# Altium project EVACC_Tester_v1_0.PrjPcb
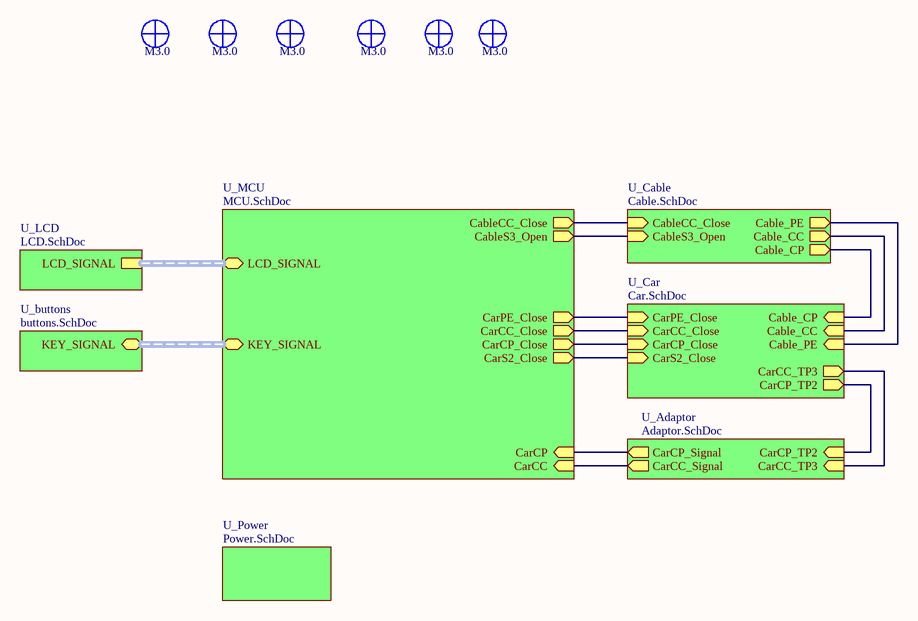
[diagram p0: layout.SchDoc]
8 sheets, 122 parts. Net scope: hierarchical (ports join the sheet entries above them; power ports are global).
Board file: EVACC_Tester_v1_0.PcbDoc
Sheets:
  layout.SchDoc
    U_MCU = MCU.SchDoc
    U_Power = Power.SchDoc
    U_Cable = Cable.SchDoc
    U_Car = Car.SchDoc
    U_LCD = LCD.SchDoc
    U_Adaptor = Adaptor.SchDoc
    U_buttons = buttons.SchDoc

## Sheet layout.SchDoc
size A4

### Parts
H1  M3.0  [SCREW_HOLE_3.5]  (value not drawn)  (no BOM)
H2  M3.0  [SCREW_HOLE_3.5]  (value not drawn)  (no BOM)
H3  M3.0  [SCREW_HOLE_3.5]  (value not drawn)  (no BOM)
H4  M3.0  [SCREW_HOLE_3.5]  (value not drawn)  (no BOM)
H5  M3.0  [SCREW_HOLE_3.5]  (value not drawn)  (no BOM)
H6  M3.0  [SCREW_HOLE_3.5]  (value not drawn)  (no BOM)

### Sub-sheets
U_Adaptor = Adaptor.SchDoc: CarCP_Signal (out), CarCP_TP2 (in), CarCC_TP3 (in), CarCC_Signal (out)
U_buttons = buttons.SchDoc: KEY_SIGNAL (harness Key)
U_Cable = Cable.SchDoc: CableCC_Close (in), Cable_CC (out), CableS3_Open (in), Cable_PE (out), Cable_CP (out)
U_Car = Car.SchDoc: Cable_CC (in), Cable_CP (in), CarPE_Close (in), CarCC_Close (in), CarCP_Close (in), CarCC_TP3 (out), CarS2_Close (in), CarCP_TP2 (out), Cable_PE (in)
U_LCD = LCD.SchDoc: LCD_SIGNAL (harness LCD)
U_MCU = MCU.SchDoc: CableCC_Close (out), CableS3_Open (out), CarPE_Close (out), CarCC_Close (out), CarCP_Close (out), CarS2_Close (out), CarCC (in), CarCP (in), LCD_SIGNAL (harness LCD), KEY_SIGNAL (harness Key)
U_Power = Power.SchDoc: no entries

### Nets
CP: sheet U_Cable/Cable_CP, sheet U_Car/Cable_CP
PE: sheet U_Cable/Cable_PE, sheet U_Car/Cable_PE
NetCar_CP_1: sheet U_MCU/CarCP, sheet U_Adaptor/CarCP_Signal
NetCMP+_1: sheet U_Car/CarCP_TP2, sheet U_Adaptor/CarCP_TP2
NetD23_1: sheet U_Car/CarCC_TP3, sheet U_Adaptor/CarCC_TP3
NetK4_6: sheet U_Cable/Cable_CC, sheet U_Car/Cable_CC
NetR5_1: sheet U_MCU/CableCC_Close, sheet U_Cable/CableCC_Close
NetR6_1: sheet U_MCU/CableS3_Open, sheet U_Cable/CableS3_Open
NetR11_1: sheet U_MCU/CarPE_Close, sheet U_Car/CarPE_Close
NetR12_1: sheet U_MCU/CarCC_Close, sheet U_Car/CarCC_Close
NetR17_1: sheet U_MCU/CarCP_Close, sheet U_Car/CarCP_Close
NetR18_1: sheet U_MCU/CarS2_Close, sheet U_Car/CarS2_Close
NetR20_2: sheet U_MCU/CarCC, sheet U_Adaptor/CarCC_Signal

### Buses and harness runs
harness sheet U_buttons/KEY_SIGNAL = sheet U_MCU/KEY_SIGNAL
harness sheet U_LCD/LCD_SIGNAL = sheet U_MCU/LCD_SIGNAL

### Library data of the parts
H1-H6 = SCRE_HOLE_3.5: Screw hole for M3.0

## Sheet MCU.SchDoc
size A4
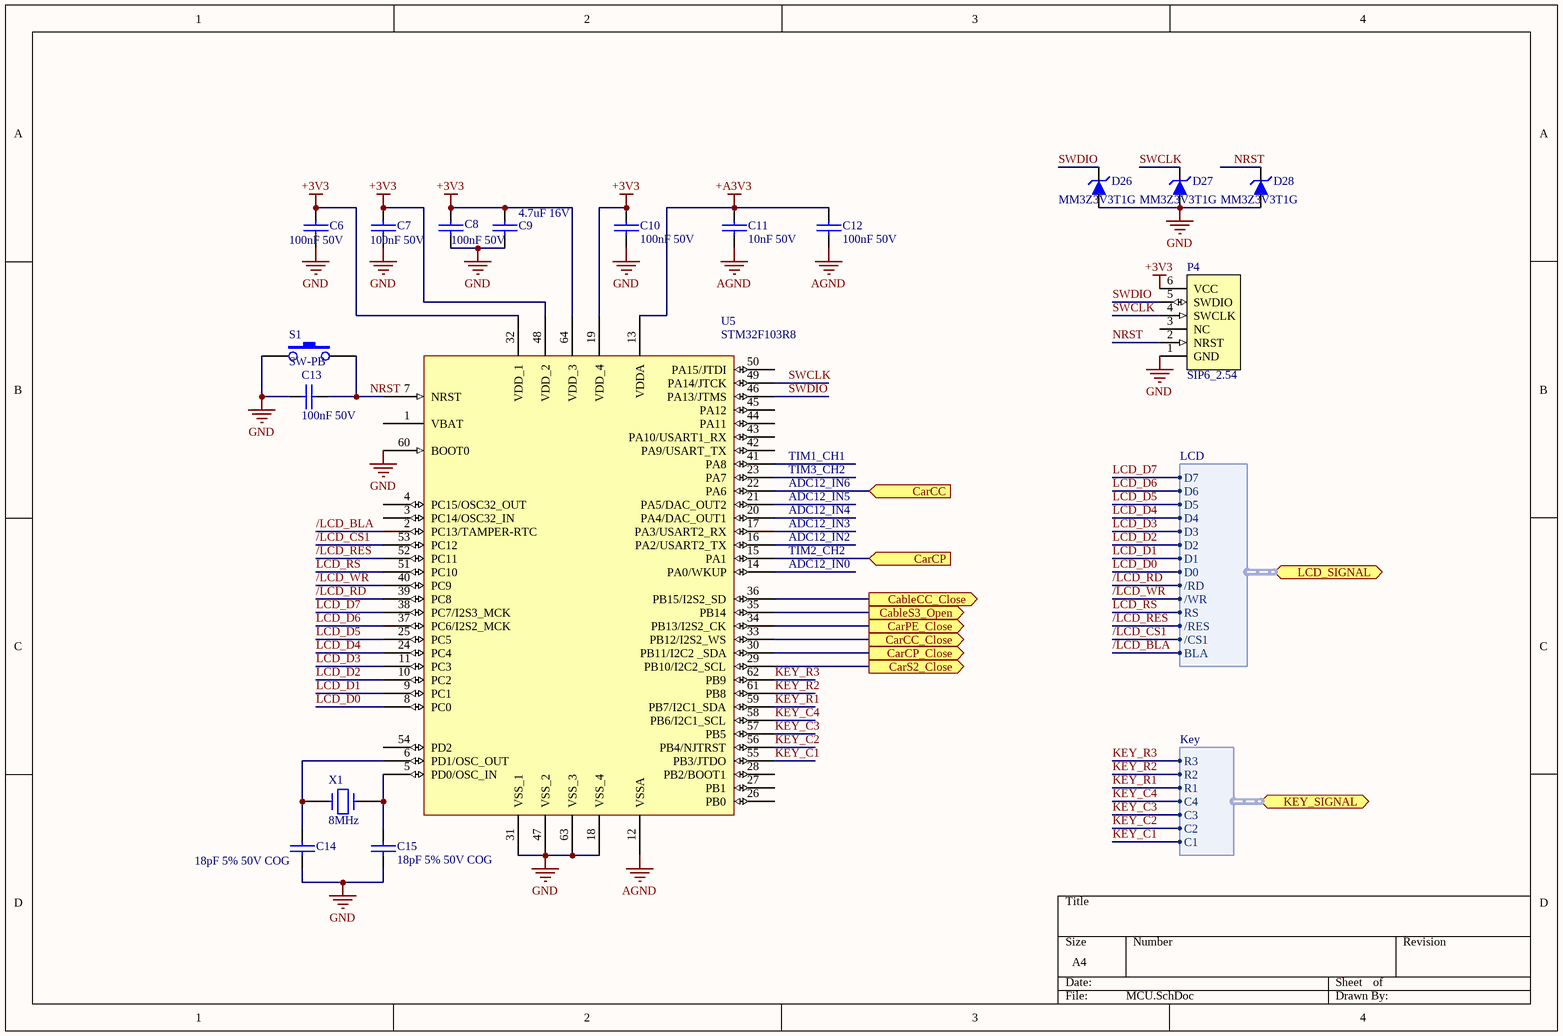
[diagram p1: MCU.SchDoc]

### Parts
C6  100nF 50V  [CAPC2012N]
C7  100nF 50V  [CAPC2012N]
C8  100nF 50V  [CAPC2012N]
C9  4.7uF 16V  [CAPC2012N]
C10  100nF 50V  [CAPC2012N]
C11  10nF 50V  [CAPC2012N]
C12  100nF 50V  [CAPC2012N]
C13  100nF 50V  [CAPC2012N]
C14  18pF 5% 50V COG  [CAPC2012N]
C15  18pF 5% 50V COG  [CAPC2012N]
D26  MM3Z3V3T1G  [SOD-323]
D27  MM3Z3V3T1G  [SOD-323]
D28  MM3Z3V3T1G  [SOD-323]
P4  SIP6_2.54  [REAL_SIP6_2.54]
S1  SW-PB  [SW5X7]  (no BOM)
U5  STM32F103R8  [TQFP64_M]
X1  8MHz  [ATSM-49]

### Ports
CableCC_Close (out), CableS3_Open (out), CarCC (in), CarCC_Close (out), CarCP (in), CarCP_Close (out), CarPE_Close (out), CarS2_Close (out), KEY_SIGNAL (harness Key), LCD_SIGNAL (harness LCD)

### Harnesses
LCD: D7, D6, D5, D4, D3, D2, D1, D0, /RD, /WR, RS, /RES, /CS1, BLA
Key: R3, R2, R1, C4, C3, C2, C1

### Nets
+3V3: C6.2 C7.1 C8.1 C9.1 C10.1 P4.6(VCC) U5.19(VDD_4) U5.32(VDD_1) U5.48(VDD_2) U5.64(VDD_3)
+A3V3: C11.1 C12.1 U5.13(VDDA)
AGND: C11.2 C12.2 U5.12(VSSA)
GND: C6.1 C7.2 C8.2 C9.2 C10.2 C13.2 C14.2 C15.1 D26.2(A) D27.2(A) D28.2(A) P4.1(GND) S1.1 U5.18(VSS_4) U5.31(VSS_1) U5.47(VSS_2) U5.60(BOOT0) U5.63(VSS_3)
/LCD_BLA: U5.2(PC13/TAMPER-RTC) ; port LCD_SIGNAL.BLA
/LCD_CS1: U5.53(PC12) ; port LCD_SIGNAL./CS1
/LCD_RD: U5.39(PC8) ; port LCD_SIGNAL./RD
/LCD_RES: U5.52(PC11) ; port LCD_SIGNAL./RES
/LCD_WR: U5.40(PC9) ; port LCD_SIGNAL./WR
KEY_C1: U5.55(PB3/JTDO) ; port KEY_SIGNAL.C1
KEY_C2: U5.56(PB4/NJTRST) ; port KEY_SIGNAL.C2
KEY_C3: U5.57(PB5) ; port KEY_SIGNAL.C3
KEY_C4: U5.58(PB6/I2C1_SCL) ; port KEY_SIGNAL.C4
KEY_R1: U5.59(PB7/I2C1_SDA) ; port KEY_SIGNAL.R1
KEY_R2: U5.61(PB8) ; port KEY_SIGNAL.R2
KEY_R3: U5.62(PB9) ; port KEY_SIGNAL.R3
LCD_D0: U5.8(PC0) ; port LCD_SIGNAL.D0
LCD_D1: U5.9(PC1) ; port LCD_SIGNAL.D1
LCD_D2: U5.10(PC2) ; port LCD_SIGNAL.D2
LCD_D3: U5.11(PC3) ; port LCD_SIGNAL.D3
LCD_D4: U5.24(PC4) ; port LCD_SIGNAL.D4
LCD_D5: U5.25(PC5) ; port LCD_SIGNAL.D5
LCD_D6: U5.37(PC6/I2S2_MCK) ; port LCD_SIGNAL.D6
LCD_D7: U5.38(PC7/I2S3_MCK) ; port LCD_SIGNAL.D7
LCD_RS: U5.51(PC10) ; port LCD_SIGNAL.RS
NRST: C13.1 D28.1(K) P4.2(NRST) S1.2 U5.7(NRST)
SWCLK: D27.1(K) P4.4(SWCLK) U5.49(PA14/JTCK)
SWDIO: D26.1(K) P4.5(SWDIO) U5.46(PA13/JTMS)
NetC14_1: C14.1 U5.6(PD1/OSC_OUT) X1.1
NetC15_2: C15.2 U5.5(PD0/OSC_IN) X1.2
NetCar_CP_1: U5.15(PA1) ; port CarCP
NetR5_1: U5.36(PB15/I2S2_SD) ; port CableCC_Close
NetR6_1: U5.35(PB14) ; port CableS3_Open
NetR11_1: U5.34(PB13/I2S2_CK) ; port CarPE_Close
NetR12_1: U5.33(PB12/I2S2_WS) ; port CarCC_Close
NetR17_1: U5.30(PB11/I2C2__SDA) ; port CarCP_Close
NetR18_1: U5.29(PB10/I2C2_SCL) ; port CarS2_Close
NetR20_2: U5.22(PA6) ; port CarCC

Not connected (* = marked no-connect by the designer): P4 3(NC); U5 1(VBAT) 3(PC14/OSC32_IN) 4(PC15/OSC32_OUT) 14(PA0/WKUP) 16(PA2/USART2_TX) 17(PA3/USART2_RX) 20(PA4/DAC_OUT1) 21(PA5/DAC_OUT2) 23(PA7) 26(PB0) 27(PB1) 28(PB2/BOOT1) 41(PA8) 42(PA9/USART_TX) 43(PA10/USART1_RX) 44(PA11) 45(PA12) 50(PA15/JTDI) 54(PD2)

### Notes on the sheet
- ADC12_IN4
- ADC12_IN5
- TIM3_CH2
- TIM1_CH1
- ADC12_IN6
- ADC12_IN2
- ADC12_IN3
- ADC12_IN0
- TIM2_CH2

### Library data of the parts
C6-C15 = CAP: Capacitor
  C6-C8 C10-C15: Price: 0.025
D26-D28 = Zener Diode: Manufacturer: ON; Price: *
P4 = SWD-Connector: SW debug connector
U5 = STM32F105RX: Price: 10.3
X1 = CRYSTAL: 晶振; Price: 0.25

## Sheet Power.SchDoc
size A4
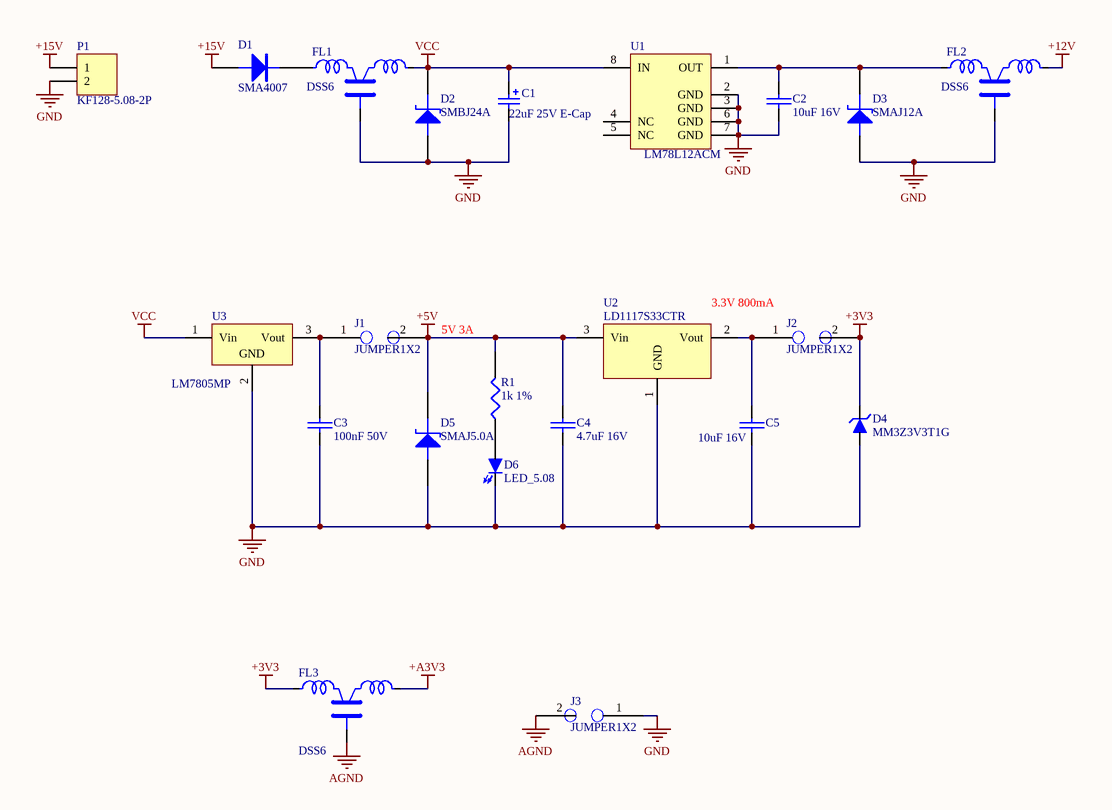
[diagram p2: Power.SchDoc]

### Parts
C1  22uF 25V E-Cap  [SMT E-Cap 5x5.4]
C2  10uF 16V  [CAPC3216N]
C3  100nF 50V  [CAPC2012N]
C4  4.7uF 16V  [CAPC2012N]
C5  10uF 16V  [CAPC3216N]
D1  SMA4007  [DSO-C2/G1.6]
D2  SMBJ24A  [DSO-C2/X2.3]
D3  SMAJ12A  [DSO-C2/G1.6]
D4  MM3Z3V3T1G  [SOD-323]
D5  SMAJ5.0A  [DSO-C2/G1.6]
D6  LED_5.08  [LED5.08/2.54-2]
FL1  DSS6  [DSS6]
FL2  DSS6  [DSS6]
FL3  DSS6  [DSS6]
J1  JUMPER1X2  [JP-SOLDER-H1X2-3X2]  (no BOM)
J2  JUMPER1X2  [JP-SOLDER-H1X2-3X2]  (no BOM)
J3  JUMPER1X2  [JP-SOLDER-H1X2-3X2]  (no BOM)
P1  KF128-5.08-2P  [KF128-5.08-2P]
R1  1k 1%  [RESC2012N]
U1  LM78L12ACM  [SO8_M]
U2  LD1117S33CTR  [SOT223-4M]
U3  LM7805MP  [SOT223-4M]

### Nets
+3V3: D4.1(K) FL3.1 J2.2
+5V: C4.1 D5.2(K) J1.2 R1.2 U2.3(Vin)
+12V: FL2.3
+15V: D1.1(A) P1.1
+A3V3: FL3.3
AGND: FL3.2 J3.2
GND: C1.2 C2.2 C3.1 C4.2 C5.2 D2.1(A) D3.1(A) D4.2(A) D5.1(A) D6.2(K) FL1.2 FL2.2 J3.1 P1.2 U1.2(GND) U1.3(GND) U1.6(GND) U1.7(GND) U2.1(GND) U3.2(GND)
VCC: C1.1 D2.2(K) FL1.3 U1.8(IN) U3.1(Vin)
NetC2_1: C2.1 D3.2(K) FL2.1 U1.1(OUT)
NetC3_2: C3.2 J1.1 U3.3(Vout)
NetC5_1: C5.1 J2.1 U2.2(Vout)
NetD1_2: D1.2(K) FL1.1
NetD6_1: D6.1(A) R1.1

Not connected (* = marked no-connect by the designer): U1 4(NC) 5(NC)

### Notes on the sheet
- 5V 3A
- 3.3V 800mA

### Library data of the parts
C1 = Cap Pol1: Polarized Capacitor (Radial); Published: 8-Jun-2000; LatestRevisionDate: 17-Jul-2002; LatestRevisionNote: Re-released for DXP Platform.; PackageReference: RB7.6-15; Publisher: Altium Limited
C2-C5 = CAP: Price: 0.025
D1 = DIODE: Price: 0.4
D2 = ZENER2: Zener Diode
D3 = ZENER2: Zener Diode; Manufacturer: Littlefuse; Price: 0.65
D4 = Zener Diode: Manufacturer: ON; Price: *
D5 = ZENER2: Zener Diode; Manufacturer: Vishay; Price: 0.65
D6 = LED_5.08: Through hole LED dia.5.08
FL1-FL3 = DSS6: Murata EMI suppression filter; Manufacturer: Murata; Price: 0.5
P1 = Header 2: Power supply connector; LatestRevisionDate: 17-Jul-2002; LatestRevisionNote: Re-released for DXP Platform.; Publisher: Altium Limited
R1 = RES1
U1 = LM78L05ACM: 3-Terminal Positive Regulators; Manufacturer: National Semiconductor; CompType: LDO IC; PackageTopMarking: NSZXTT*LM78L*05ACM; Published: 4-Dec-2008; DatasheetVersion: Apr-2006; PackageVersion: revL, Sep-2006; PackageReference: M08A; Publisher: Altium Limited; PackageDescription: SOIC Narrow, 4.9 x 3.9 x 1.45mm, 8 Lead, 1.27mm Pitch; PartNumber: LM78L05ACM; RoHS: O; PinCount: 8; DigiKeyPartNumber: LM78L05ACM-ND; Code_JEDEC: MS-012-AA; ComponentLink1Description: LM78L05 Datasheet; ComponentLink1URL: http://www.national.com/ds/LM/LM78L05.pdf; ComponentLink2Description: LM78L05 Web Page; ComponentLink2URL: http://www.national.com/pf/LM/LM78L05.html; ComponentLink3Description: M08A Package Page; ComponentLink3URL: http://www.national.com/packaging/folders/m08a.html; Code_IPC: SOIC127P600-8
U2 = VOLTREG: ST Low drop voltage regulator; Price: 1.5; Manufacturer: ST
U3 = Volt Reg: Voltage Regulator; Published: 24-Mar-1999; LatestRevisionDate: 29-May-2009; LatestRevisionNote: IPC-7351 Footprint Added.; PackageReference: D2PAK; Publisher: Altium Limited; PackageDescription: 3-Pin Transistor Outline Package 2.54 mm Pitch, 15.1 mm Lead Span

## Sheet Cable.SchDoc
size A4
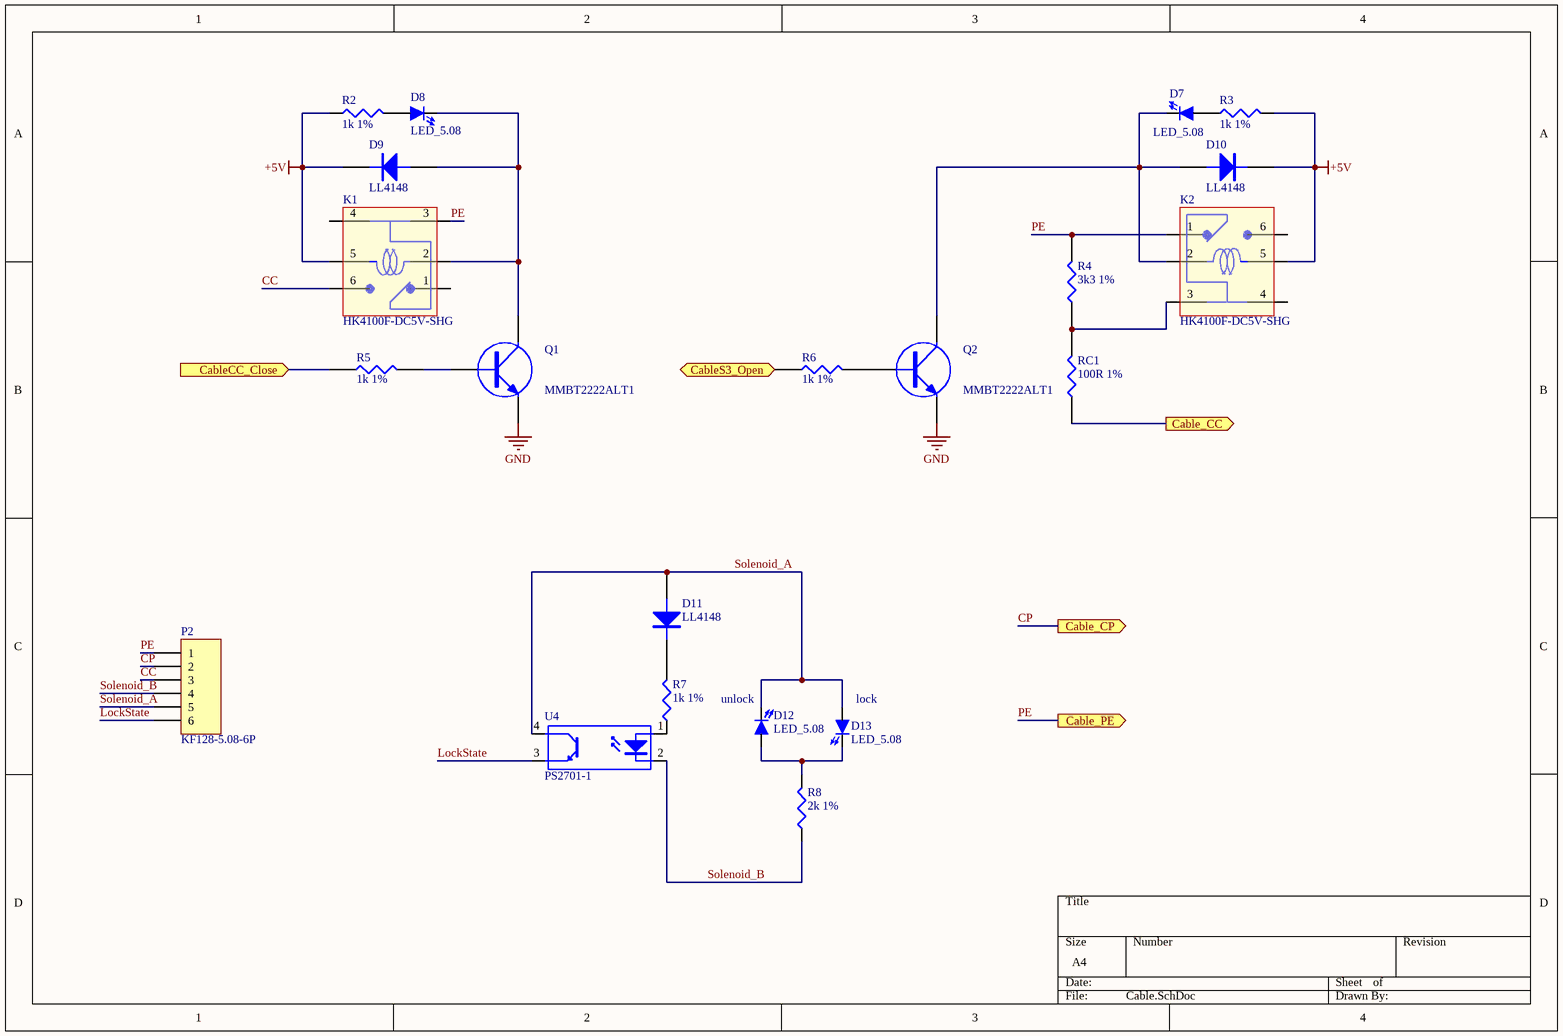
[diagram p3: Cable.SchDoc]

### Parts
D7  LED_5.08  [LED5.08/2.54-2]
D8  LED_5.08  [LED5.08/2.54-2]
D9  LL4148  [MELF-D3513-1405]
D10  LL4148  [MELF-D3513-1405]
D11  LL4148  [MELF-D3513-1405]
D12  LED_5.08  [LED5.08/2.54-2]
D13  LED_5.08  [LED5.08/2.54-2]
K1  HK4100F-DC5V-SHG  [HK4100F-DC5V-SHG]
K2  HK4100F-DC5V-SHG  [HK4100F-DC5V-SHG]
P2  KF128-5.08-6P  [KF128-5.08-6P]
Q1  MMBT2222ALT1  [SOT23-3M]
Q2  MMBT2222ALT1  [SOT23-3M]
R2  1k 1%  [RESC2012N]
R3  1k 1%  [RESC2012N]
R4  3k3 1%  [RESC2012N]
R5  1k 1%  [RESC2012N]
R6  1k 1%  [RESC2012N]
R7  1k 1%  [RESC2012N]
R8  2k 1%  [RESC2012N]
RC1  100R 1%  [RESC2012N]
U4  PS2701-1  [SOP4 for PS2701-1]

### Ports
Cable_CC (out), Cable_CP (out), Cable_PE (out), CableCC_Close (in), CableS3_Open (in)

### Nets
+5V: D9.2(K) D10.2(K) K1.5 K2.5 R2.1 R3.2
GND: Q1.2(E) Q2.2(E)
CC: K1.6 P2.3
CP: P2.2 ; port Cable_CP
LockState: P2.6 U4.3(E)
PE: K1.3 K2.1 P2.1 R4.2 ; port Cable_PE
Solenoid_A: D11.1(A) D12.2(K) D13.1(A) P2.5 U4.4(C)
Solenoid_B: P2.4 R8.1 U4.2(K)
NetD7_1: D7.1(A) R3.1
NetD7_2: D7.2(K) D10.1(A) K2.2 Q2.3(C)
NetD8_1: D8.1(A) R2.2
NetD8_2: D8.2(K) D9.1(A) K1.2 Q1.3(C)
NetD11_2: D11.2(K) R7.2
NetD12_1: D12.1(A) D13.2(K) R8.2
NetK2_3: K2.3 R4.1 RC1.2
NetK4_6: RC1.1 ; port Cable_CC
NetQ1_1: Q1.1(B) R5.2
NetQ2_1: Q2.1(B) R6.2
NetR5_1: R5.1 ; port CableCC_Close
NetR6_1: R6.1 ; port CableS3_Open
NetR7_1: R7.1 U4.1(A)

Not connected (* = marked no-connect by the designer): K1 1 4; K2 4 6

### Notes on the sheet
- (near D12) unlock
- (near D13) lock

### Library data of the parts
D7 D8 D12 D13 = LED_5.08: Through hole LED dia.5.08
D9-D11 = DIODE: Price: 0.03
K1 K2 = HK4100F-DC5V-SHG: HUI KE DC5V relay
P2 = Header 6: Pilot connectors; LatestRevisionDate: 17-Jul-2002; LatestRevisionNote: Re-released for DXP Platform.; Publisher: Altium Limited
Q1 Q2 = NPN: Price: 0.25
R2 R3 R7 R8 = Res3: Resistor
R4-R6 RC1 = RES1
U4 = PS2701-1: Photocoupler; Price: 0.52

## Sheet Car.SchDoc
size A4
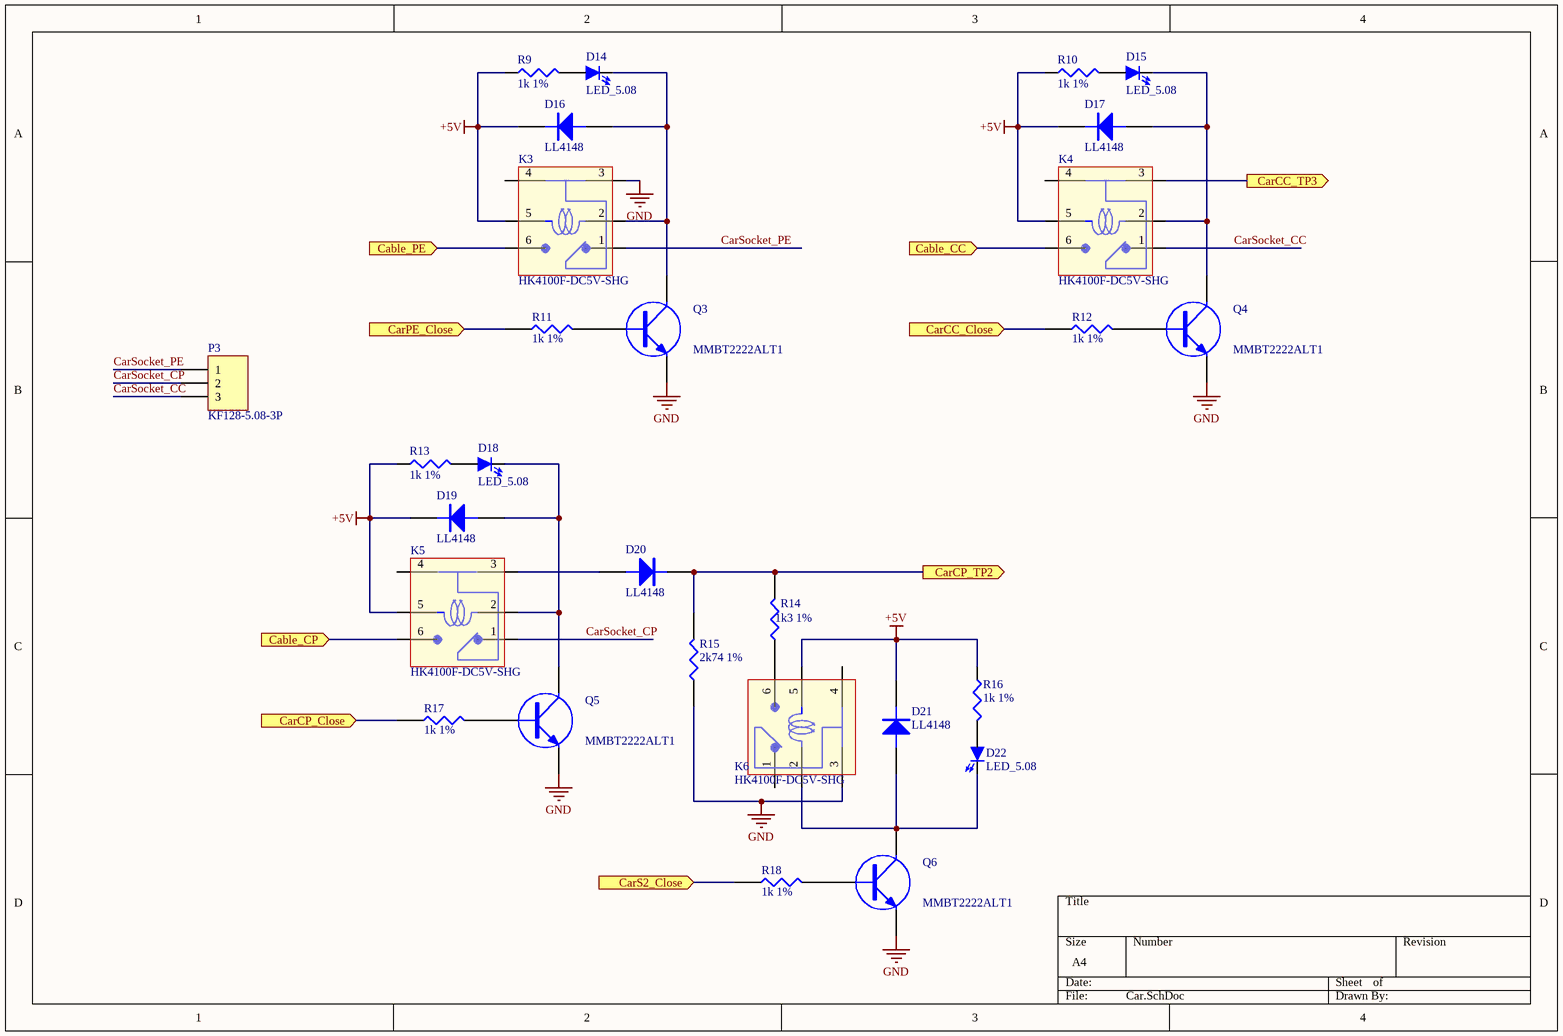
[diagram p4: Car.SchDoc]

### Parts
D14  LED_5.08  [LED5.08/2.54-2]
D15  LED_5.08  [LED5.08/2.54-2]
D16  LL4148  [MELF-D3513-1405]
D17  LL4148  [MELF-D3513-1405]
D18  LED_5.08  [LED5.08/2.54-2]
D19  LL4148  [MELF-D3513-1405]
D20  LL4148  [MELF-D3513-1405]
D21  LL4148  [MELF-D3513-1405]
D22  LED_5.08  [LED5.08/2.54-2]
K3  HK4100F-DC5V-SHG  [HK4100F-DC5V-SHG]
K4  HK4100F-DC5V-SHG  [HK4100F-DC5V-SHG]
K5  HK4100F-DC5V-SHG  [HK4100F-DC5V-SHG]
K6  HK4100F-DC5V-SHG  [HK4100F-DC5V-SHG]
P3  KF128-5.08-3P  [KF128-5.08-3P]
Q3  MMBT2222ALT1  [SOT23-3M]
Q4  MMBT2222ALT1  [SOT23-3M]
Q5  MMBT2222ALT1  [SOT23-3M]
Q6  MMBT2222ALT1  [SOT23-3M]
R9  1k 1%  [RESC2012N]
R10  1k 1%  [RESC2012N]
R11  1k 1%  [RESC2012N]
R12  1k 1%  [RESC2012N]
R13  1k 1%  [RESC2012N]
R14  1k3 1%  [RESC2012N]
R15  2k74 1%  [RESC2012N]
R16  1k 1%  [RESC2012N]
R17  1k 1%  [RESC2012N]
R18  1k 1%  [RESC2012N]

### Ports
Cable_CC (in), Cable_CP (in), Cable_PE (in), CarCC_Close (in), CarCC_TP3 (out), CarCP_Close (in), CarCP_TP2 (out), CarPE_Close (in), CarS2_Close (in)

### Nets
+5V: D16.2(K) D17.2(K) D19.2(K) D21.2(K) K3.5 K4.5 K5.5 K6.5 R9.1 R10.1 R13.1 R16.1
GND: K3.3 K6.3 Q3.2(E) Q4.2(E) Q5.2(E) Q6.2(E) R15.1
CarSocket_CC: K4.1 P3.3
CarSocket_CP: K5.1 P3.2
CarSocket_PE: K3.1 P3.1
CP: K5.6 ; port Cable_CP
PE: K3.6 ; port Cable_PE
NetCMP+_1: D20.2(K) R14.2 R15.2 ; port CarCP_TP2
NetD14_1: D14.1(A) R9.2
NetD14_2: D14.2(K) D16.1(A) K3.2 Q3.3(C)
NetD15_1: D15.1(A) R10.2
NetD15_2: D15.2(K) D17.1(A) K4.2 Q4.3(C)
NetD18_1: D18.1(A) R13.2
NetD18_2: D18.2(K) D19.1(A) K5.2 Q5.3(C)
NetD20_1: D20.1(A) K5.3
NetD21_1: D21.1(A) D22.2(K) K6.2 Q6.3(C)
NetD22_1: D22.1(A) R16.2
NetD23_1: K4.3 ; port CarCC_TP3
NetK4_6: K4.6 ; port Cable_CC
NetK6_6: K6.6 R14.1
NetQ3_1: Q3.1(B) R11.2
NetQ4_1: Q4.1(B) R12.2
NetQ5_1: Q5.1(B) R17.2
NetQ6_1: Q6.1(B) R18.2
NetR11_1: R11.1 ; port CarPE_Close
NetR12_1: R12.1 ; port CarCC_Close
NetR17_1: R17.1 ; port CarCP_Close
NetR18_1: R18.1 ; port CarS2_Close

Not connected (* = marked no-connect by the designer): K3 4; K4 4; K5 4; K6 1 4

### Library data of the parts
D14 D15 D18 D22 = LED_5.08: Through hole LED dia.5.08
D16 D17 D19-D21 = DIODE: Price: 0.03
K3-K6 = HK4100F-DC5V-SHG: HUI KE DC5V relay
P3 = Header 3: Car socket connector; LatestRevisionDate: 17-Jul-2002; LatestRevisionNote: Re-released for DXP Platform.; Publisher: Altium Limited
Q3-Q6 = NPN: Price: 0.25
R9 R10 R13 R16 = Res3: Resistor
R11 R12 R14 R15 R17 R18 = RES1

## Sheet LCD.SchDoc
size A4
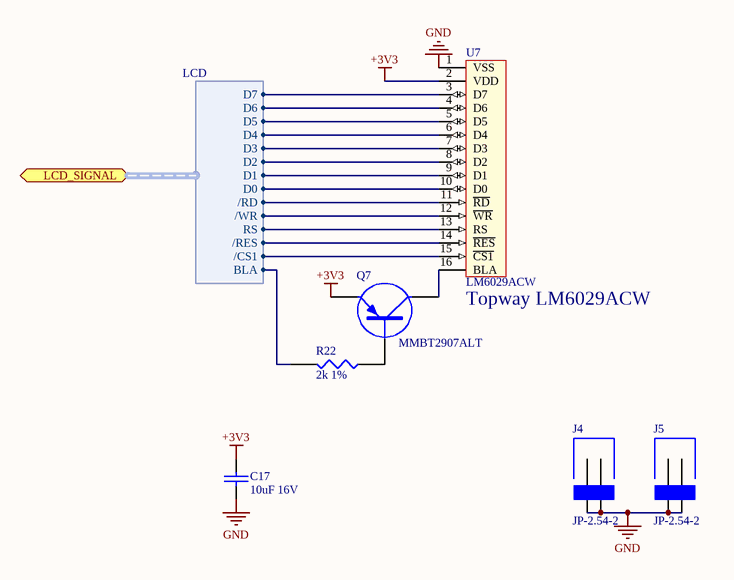
[diagram p5: LCD.SchDoc]

### Parts
C17  10uF 16V  [CAPC3216N]
J4  JP-2.54-2  [JP2-P2.54]
J5  JP-2.54-2  [JP2-P2.54]
Q7  MMBT2907ALT  [SOT23-3M]
R22  2k 1%  [RESC2012N]
U7  LM6029ACW  [LM6029A]

### Ports
LCD_SIGNAL (harness LCD)

### Harnesses
LCD: D7, D6, D5, D4, D3, D2, D1, D0, /RD, /WR, RS, /RES, /CS1, BLA

### Nets
+3V3: C17.1 Q7.2(E) U7.2(VDD)
GND: C17.2 J4.1 J4.2 J5.1 J5.2 U7.1(VSS)
/LCD_BLA: R22.2 ; port LCD_SIGNAL.BLA
/LCD_CS1: U7.15(~{CS1}) ; port LCD_SIGNAL./CS1
/LCD_RD: U7.11(~{RD}) ; port LCD_SIGNAL./RD
/LCD_RES: U7.14(~{RES}) ; port LCD_SIGNAL./RES
/LCD_WR: U7.12(~{WR}) ; port LCD_SIGNAL./WR
LCD_D0: U7.10(D0) ; port LCD_SIGNAL.D0
LCD_D1: U7.9(D1) ; port LCD_SIGNAL.D1
LCD_D2: U7.8(D2) ; port LCD_SIGNAL.D2
LCD_D3: U7.7(D3) ; port LCD_SIGNAL.D3
LCD_D4: U7.6(D4) ; port LCD_SIGNAL.D4
LCD_D5: U7.5(D5) ; port LCD_SIGNAL.D5
LCD_D6: U7.4(D6) ; port LCD_SIGNAL.D6
LCD_D7: U7.3(D7) ; port LCD_SIGNAL.D7
LCD_RS: U7.13(RS) ; port LCD_SIGNAL.RS
NetQ7_1: Q7.1(B) R22.1
NetQ7_3: Q7.3(C) U7.16(BLA)

### Notes on the sheet
- (near U7) Topway LM6029ACW

### Library data of the parts
C17 = CAP: Capacitor
J4 J5 = JP2-2.54
Q7 = MMBT3906: PNP transitor; Price: 0.25
R22 = RES1: Price: 0.0025
U7 = LM6029A: Topway LCD module 3.3V; Price: 35

## Sheet Adaptor.SchDoc
size A4
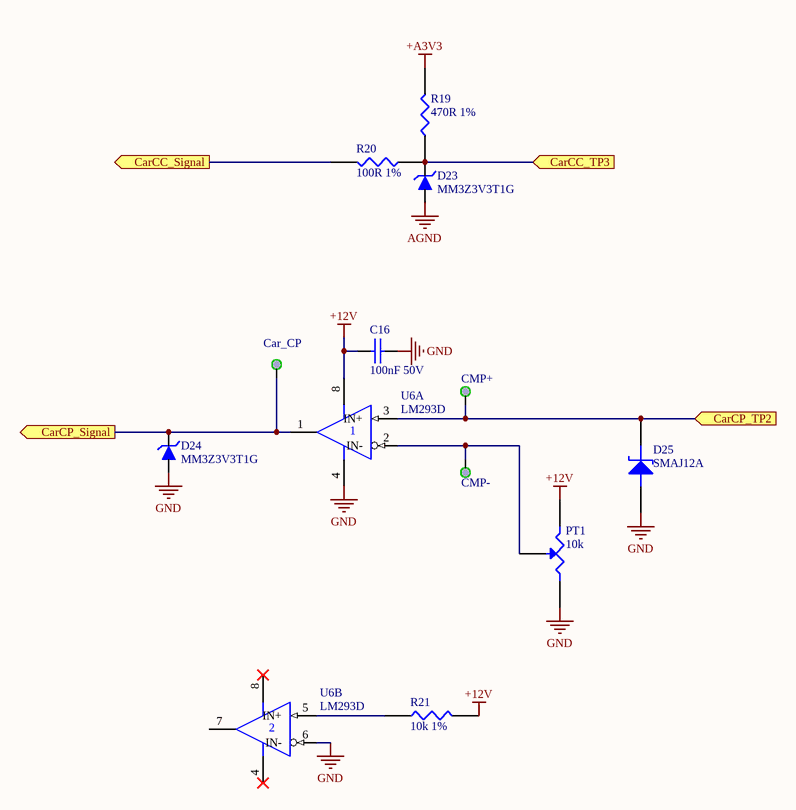
[diagram p6: Adaptor.SchDoc]

### Parts
C16  100nF 50V  [CAPC2012N]
Car_CP  IR PULSE  [TP1.4/1.0]  (value not drawn)  (no BOM)
CMP+  CMP+  [TP1.4/1.0]  (value not drawn)  (no BOM)
CMP-  CMP-  [TP1.4/1.0]  (value not drawn)  (no BOM)
D23  MM3Z3V3T1G  [SOD-323]
D24  MM3Z3V3T1G  [SOD-323]
D25  SMAJ12A  [DSO-C2/G1.6]
PT1  10k  [VR-3362P]
R19  470R 1%  [RESC2012N]
R20  100R 1%  [RESC2012N]
R21  10k 1%  [RESC2012N]
U6  LM293D  [SO8_M]  (parts A,B of 2)

### Ports
CarCC_Signal (out), CarCC_TP3 (in), CarCP_Signal (out), CarCP_TP2 (in)

### Nets
+12V: C16.2 PT1.1 R21.2 U6.8(VCC)
+A3V3: R19.2
AGND: D23.2(A)
GND: C16.1 D24.2(A) D25.1(A) PT1.3 U6.4(GND) U6.6(IN-)
NetCar_CP_1: Car_CP.1 D24.1(K) U6.1(OUT) ; port CarCP_Signal
NetCMP+_1: CMP+.1 D25.2(K) U6.3(IN+) ; port CarCP_TP2
NetCMP-_1: CMP-.1 PT1.2(W) U6.2(IN-)
NetD23_1: D23.1(K) R19.1 R20.1 ; port CarCC_TP3
NetR20_2: R20.2 ; port CarCC_Signal
NetR21_1: R21.1 U6.5(IN+)

Not connected (* = marked no-connect by the designer): U6 7(OUT)

### Library data of the parts
C16 = CAP: Capacitor; Price: 0.025
Car_CP CMP+ CMP- = TP1.4/1.0
D23 D24 = Zener Diode: Manufacturer: ON; Price: *
D25 = ZENER2: Zener Diode; Manufacturer: Littlefuse; Price: 0.65
PT1 = POT1: 电位器; Price: 0.5
R19-R21 = RES1
U6 = LM393D: Dual Differential Comparator; Published: 15-Apr-2002; LatestRevisionDate: 13-Apr-2006; LatestRevisionNote: IPC-7351 Footprint Added.; DatasheetVersion: Nov-1988; PackageVersion: Jan-1998; PackageReference: D008; Publisher: Altium Limited; PackageDescription: 8-Pin Small Outline Integrated Circuit 1.27 mm Pitch; Code_IPC: SOIC127P600-8; ComponentLink1Description: Manufacturer Link; ComponentLink1URL: http://www.ti.com/; ComponentLink2Description: Datasheet; ComponentLink2URL: http://www-s.ti.com/sc/ds/lm193.pdf; Price: 0.8

## Sheet buttons.SchDoc
size A4
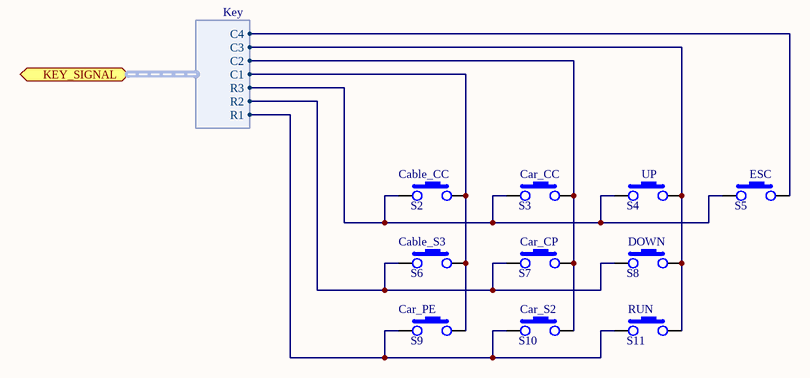
[diagram p7: buttons.SchDoc]

### Parts
S2  SKHCBJA010  [SKHCBJA010]  (value not drawn)
S3  SKHCBJA010  [SKHCBJA010]  (value not drawn)
S4  SKHCBJA010  [SKHCBJA010]  (value not drawn)
S5  SKHCBJA010  [SKHCBJA010]  (value not drawn)
S6  SKHCBJA010  [SKHCBJA010]  (value not drawn)
S7  SKHCBJA010  [SKHCBJA010]  (value not drawn)
S8  SKHCBJA010  [SKHCBJA010]  (value not drawn)
S9  SKHCBJA010  [SKHCBJA010]  (value not drawn)
S10  SKHCBJA010  [SKHCBJA010]  (value not drawn)
S11  SKHCBJA010  [SKHCBJA010]  (value not drawn)

### Ports
KEY_SIGNAL (harness Key)

### Harnesses
Key: R3, R2, R1, C4, C3, C2, C1

### Nets
KEY_C1: S2.3 S6.3 S9.3 ; port KEY_SIGNAL.C1
KEY_C2: S3.3 S7.3 S10.3 ; port KEY_SIGNAL.C2
KEY_C3: S4.3 S8.3 S11.3 ; port KEY_SIGNAL.C3
KEY_C4: S5.3 ; port KEY_SIGNAL.C4
KEY_R1: S9.1 S10.1 S11.1 ; port KEY_SIGNAL.R1
KEY_R2: S6.1 S7.1 S8.1 ; port KEY_SIGNAL.R2
KEY_R3: S2.1 S3.1 S4.1 S5.1 ; port KEY_SIGNAL.R3

### Notes on the sheet
- (near S2) Cable_CC
- (near S3) Car_CC
- (near S4) UP
- (near S5) ESC
- (near S6) Cable_S3
- (near S7) Car_CP
- (near S8) DOWN
- (near S9) Car_PE
- (near S10) Car_S2
- (near S11) RUN

### Library data of the parts
S2-S11 = SKHCBJA010: Alps tact switch 12x12

## Nets that join several sheets
+3V3: MCU (10 pins), Power (D4.1 FL3.1 J2.2), LCD (C17.1 Q7.2 U7.2)
+5V: Power (5 pins), Cable (6 pins), Car (12 pins)
+12V: Power (FL2.3), Adaptor (C16.2 PT1.1 R21.2 U6.8)
+A3V3: MCU (C11.1 C12.1 U5.13), Power (FL3.3), Adaptor (R19.2)
AGND: MCU (C11.2 C12.2 U5.12), Power (FL3.2 J3.2), Adaptor (D23.2)
GND: MCU (18 pins), Power (20 pins), Cable (Q1.2 Q2.2), Car (7 pins), LCD (6 pins), Adaptor (6 pins)
/LCD_BLA: MCU (U5.2), LCD (R22.2)
/LCD_CS1: MCU (U5.53), LCD (U7.15)
/LCD_RD: MCU (U5.39), LCD (U7.11)
/LCD_RES: MCU (U5.52), LCD (U7.14)
/LCD_WR: MCU (U5.40), LCD (U7.12)
CP: Cable (P2.2), Car (K5.6)
KEY_C1: MCU (U5.55), buttons (S2.3 S6.3 S9.3)
KEY_C2: MCU (U5.56), buttons (S3.3 S7.3 S10.3)
KEY_C3: MCU (U5.57), buttons (S4.3 S8.3 S11.3)
KEY_C4: MCU (U5.58), buttons (S5.3)
KEY_R1: MCU (U5.59), buttons (S9.1 S10.1 S11.1)
KEY_R2: MCU (U5.61), buttons (S6.1 S7.1 S8.1)
KEY_R3: MCU (U5.62), buttons (S2.1 S3.1 S4.1 S5.1)
LCD_D0: MCU (U5.8), LCD (U7.10)
LCD_D1: MCU (U5.9), LCD (U7.9)
LCD_D2: MCU (U5.10), LCD (U7.8)
LCD_D3: MCU (U5.11), LCD (U7.7)
LCD_D4: MCU (U5.24), LCD (U7.6)
LCD_D5: MCU (U5.25), LCD (U7.5)
LCD_D6: MCU (U5.37), LCD (U7.4)
LCD_D7: MCU (U5.38), LCD (U7.3)
LCD_RS: MCU (U5.51), LCD (U7.13)
NetCar_CP_1: MCU (U5.15), Adaptor (Car_CP.1 D24.1 U6.1)
NetCMP+_1: Car (D20.2 R14.2 R15.2), Adaptor (CMP+.1 D25.2 U6.3)
NetD23_1: Car (K4.3), Adaptor (D23.1 R19.1 R20.1)
NetK4_6: Cable (RC1.1), Car (K4.6)
NetR5_1: MCU (U5.36), Cable (R5.1)
NetR6_1: MCU (U5.35), Cable (R6.1)
NetR11_1: MCU (U5.34), Car (R11.1)
NetR12_1: MCU (U5.33), Car (R12.1)
NetR17_1: MCU (U5.30), Car (R17.1)
NetR18_1: MCU (U5.29), Car (R18.1)
NetR20_2: MCU (U5.22), Adaptor (R20.2)
PE: Cable (K1.3 K2.1 P2.1 R4.2), Car (K3.6)